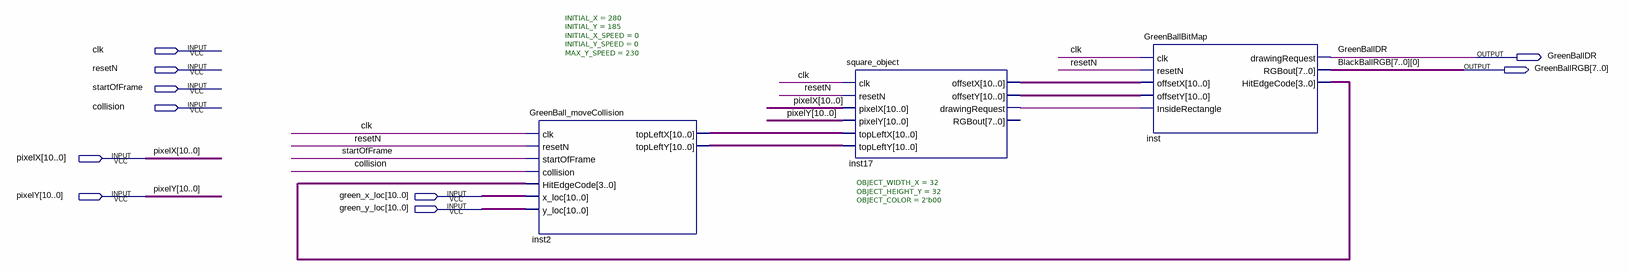
[diagram p0: schematic sheet]
// Quartus schematic GreenBall_Block.bdf as structural Verilog: 3 symbols, 10 pins
module GreenBall_Block (
  input  clk,
  input  resetN,
  input  startOfFrame,
  input  collision,
  input  [10:0] pixelX,
  input  [10:0] pixelY,
  input  [10:0] green_x_loc,
  input  [10:0] green_y_loc,
  output GreenBallDR,
  output [7:0] GreenBallRGB
);

  wire inst17_drawingrequest;
  wire [3:0] inst_hitedgecode;
  wire [10:0] inst2_topleftx, inst2_toplefty, inst17_offsetx, inst17_offsety;

  GreenBall_moveCollision #(.INITIAL_X(280), .INITIAL_Y(185), .INITIAL_X_SPEED(0), .INITIAL_Y_SPEED(0), .MAX_Y_SPEED(230)) inst2 (
    .clk(clk), .resetN(resetN), .startOfFrame(startOfFrame), .collision(collision),
    .HitEdgeCode(inst_hitedgecode), .x_loc(green_x_loc), .y_loc(green_y_loc), .topLeftX(inst2_topleftx),
    .topLeftY(inst2_toplefty));
  square_object #(.OBJECT_WIDTH_X(32), .OBJECT_HEIGHT_Y(32), .OBJECT_COLOR(2'b00)) inst17 (
    .clk(clk), .resetN(resetN), .pixelX(pixelX), .pixelY(pixelY), .topLeftX(inst2_topleftx),
    .topLeftY(inst2_toplefty), .offsetX(inst17_offsetx), .offsetY(inst17_offsety),
    .drawingRequest(inst17_drawingrequest));  // open: RGBout
  GreenBallBitMap inst (
    .clk(clk), .resetN(resetN), .offsetX(inst17_offsetx), .offsetY(inst17_offsety),
    .InsideRectangle(inst17_drawingrequest), .drawingRequest(GreenBallDR), .RGBout(GreenBallRGB),
    .HitEdgeCode(inst_hitedgecode));

  // Other names for the same wires on the sheet: BlackBallRGB_0[0] = GreenBallRGB[0];
  //   BlackBallRGB_1[0] = GreenBallRGB[1]; BlackBallRGB_2[0] = GreenBallRGB[2]; BlackBallRGB_3[0] = GreenBallRGB[3];
  //   BlackBallRGB_4[0] = GreenBallRGB[4]; BlackBallRGB_5[0] = GreenBallRGB[5]; BlackBallRGB_6[0] = GreenBallRGB[6];
  //   BlackBallRGB_7[0] = GreenBallRGB[7]
endmodule
